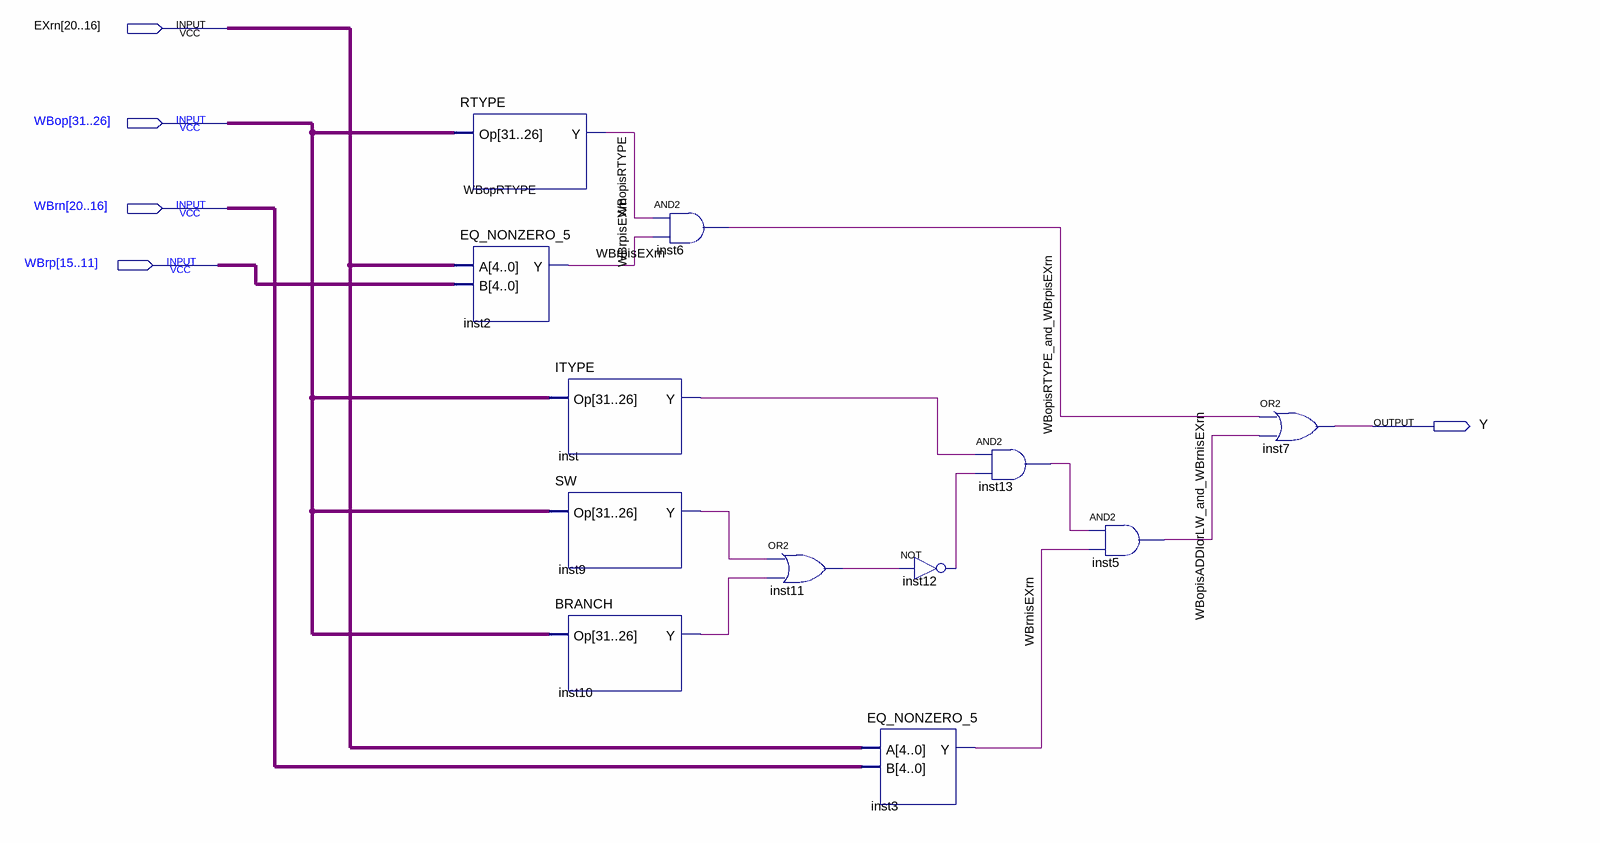
[diagram p0: schematic sheet]
// Quartus schematic ForwardBfromWBtoEX.bdf as structural Verilog: 12 symbols, 5 pins
module ForwardBfromWBtoEX (
  input  [20:16] EXrn,
  input  [31:26] WBop,
  input  [20:16] WBrn,
  input  [15:11] WBrp,
  output Y
);

  wire inst9_y, inst10_y, inst11_out, inst12_out, inst13_out, inst_y, WBopisADDIorLW_and_WBrnisEXrn,
       WBopisRTYPE, WBopisRTYPE_and_WBrpisEXrn, WBrnisEXrn, WBrpisEXrn;

  RTYPE WBopRTYPE (.Op(WBop), .Y(WBopisRTYPE));
  EQ_NONZERO_5 inst2 (.A(EXrn), .B(WBrp), .Y(WBrpisEXrn));
  ITYPE inst (.Op(WBop), .Y(inst_y));
  SW inst9 (.Op(WBop), .Y(inst9_y));
  BRANCH inst10 (.Op(WBop), .Y(inst10_y));
  and inst6 (WBopisRTYPE_and_WBrpisEXrn, WBopisRTYPE, WBrpisEXrn);
  or inst11 (inst11_out, inst9_y, inst10_y);
  EQ_NONZERO_5 inst3 (.A(EXrn), .B(WBrn), .Y(WBrnisEXrn));
  not inst12 (inst12_out, inst11_out);
  and inst13 (inst13_out, inst_y, inst12_out);
  and inst5 (WBopisADDIorLW_and_WBrnisEXrn, inst13_out, WBrnisEXrn);
  or inst7 (Y, WBopisRTYPE_and_WBrpisEXrn, WBopisADDIorLW_and_WBrnisEXrn);
endmodule
